# Altium project pcbLabIEEE.PrjPcb
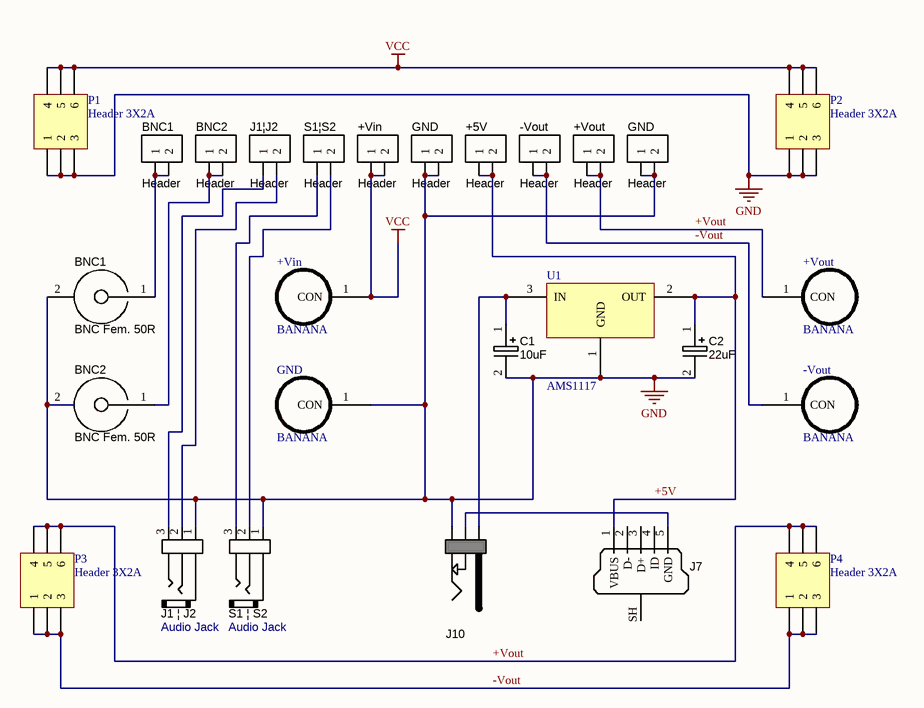
[diagram p0: pcbLabIEEE.SchDoc]
1 sheet, 27 parts. Net scope: global (net labels, ports and power ports of the same name join across sheets).
Board files: pcbLabIEEE.PcbDoc, LogoIEEEscale1.PcbDoc, LogoIEEEscale2.PcbDoc

## Sheet pcbLabIEEE.SchDoc
size A4

### Parts
(Parts that share a designator on the sheet are numbered #1, #2 ... from top to bottom, then left to right.)
+5V  Header  [HDR1X2]  (no BOM)
+Vin#1  Header  [HDR1X2]  (no BOM)
+Vin#2  BANANA  [Banana]
+Vout#1  Header  [HDR1X2]  (no BOM)
+Vout#2  BANANA  [Banana]
-Vout#1  Header  [HDR1X2]  (no BOM)
-Vout#2  BANANA  [Banana]
BNC1#1  Header  [HDR1X2]  (no BOM)
BNC1#2  BNC Fem. 50R  [CONN_BNC]
BNC2#1  Header  [HDR1X2]  (no BOM)
BNC2#2  BNC Fem. 50R  [CONN_BNC]
C1  10uF  [Capacitor_E]
C2  22uF  [Capacitor_E]
GND#1  Header  [HDR1X2]  (no BOM)
GND#2  Header  [HDR1X2]  (no BOM)
GND#3  BANANA  [Banana]
J1_|_J2  Audio Jack  [CONN_AUDIO]
J1|J2  Header  [HDR1X2]  (no BOM)
J7  USB Micro Type B (recommended if hand soldering)  [USB_MICRO-B_v2]  (value not drawn)
J10  CONN_PWR_JACK_2.1x5.5mm  [CONN_PWR_JACK_2.1x5.5mm]  (value not drawn)
P1  Header 3X2A  [HDR2X3_CEN]
P2  Header 3X2A  [HDR2X3_CEN]
P3  Header 3X2A  [HDR2X3_CEN]
P4  Header 3X2A  [HDR2X3_CEN]
S1_|_S2  Audio Jack  [CONN_AUDIO]
S1|S2  Header  [HDR1X2]  (no BOM)
U1  AMS1117  [SOT223]

### Nets
GND: BNC1#2.2 BNC2#2.2 C1.2 C2.2 GND#1.1 GND#1.2 GND#2.1 GND#2.2 GND#3.1(CON) J1_|_J2.1(Base) J10.2 P1.1 P1.2 P1.3 P2.1 P2.2 P2.3 S1_|_S2.1(Base) U1.1(GND)
VCC: +Vin#1.1 +Vin#1.2 +Vin#2.1(CON) P1.4 P1.5 P1.6 P2.4 P2.5 P2.6
+5V: +5V.1 +5V.2 C2.1 J7.1(VBUS) U1.2(OUT)
+Vout: +Vout#1.1 +Vout#1.2 +Vout#2.1(CON) P3.4 P3.5 P3.6 P4.4 P4.5 P4.6
-Vout: -Vout#1.1 -Vout#1.2 -Vout#2.1(CON) P3.1 P3.2 P3.3 P4.1 P4.2 P4.3
NetBNC1#1_1: BNC1#1.1 BNC1#1.2 BNC1#2.1
NetBNC2#1_1: BNC2#1.1 BNC2#1.2 BNC2#2.1
NetC1_1: C1.1 J10.1 U1.3(IN)
NetJ1_|_J2_2: J1_|_J2.2(Middle) J1|J2.2
NetJ1_|_J2_3: J1_|_J2.3(TIP) J1|J2.1
NetJ7_5: J7.5(GND) J10.3
NetS1_|_S2_2: S1_|_S2.2(Middle) S1|S2.2
NetS1_|_S2_3: S1_|_S2.3(TIP) S1|S2.1

Not connected (* = marked no-connect by the designer): J7 2(D-) 3(D+) 4(ID) SH(Shell)

### Library data of the parts
+5V +Vin#1 +Vout#1 -Vout#1 BNC1#1 BNC2#1 GND#1 GND#2 J1|J2 S1|S2 = Header2P: Header, 2-pin
+Vin#2 +Vout#2 -Vout#2 GND#3 = BANANA: Female Connector
BNC1#2 BNC2#2 = CONN_BNC_FEM_50R: Connector BNC 50 Ohm right-angle PCB mounted; Impedance: 50 Ohm; Ratings: 9400pF; 1500V; SCDType: undef; Category: Connectors; Mounting Type: Through Hole; ComponentLink1URL: http://www.te.com/commerce/DocumentDelivery/DDEController?Action=srchrtrv&DocNm=5413515&DocType=Customer+Drawing&DocLang=English; ComponentLink1Description: TE Datasheet
C1 C2 = CAPE: Value: uF
J1_|_J2 S1_|_S2 = CONN_MINIPHONEJACK: Stereo phone jack mini; SCDType: undef; Material: Plastic, metal
J7 = USB_Micro_TypeB_FCI: Connector SMD-THD USB Micro Type B middle mount; Manufacturer 1: FCI; Manufacturer Part Number 1: 10103593-0001LF; SCDType: undef; Package / Case: SMD/THD mid-mount; Supplier 1: Digi-Key; Supplier Part Number 1: 609-4049-1-ND
P1-P4 = Header 3X2A: Header, 3-Pin, Dual row; LatestRevisionDate: 17-Jul-2002; LatestRevisionNote: Re-released for DXP Platform.; Publisher: Altium Limited
U1 = AMS1117: Voltage Regulator